# EAGLE design Teensy_PCB (EAGLE 9.4.2)
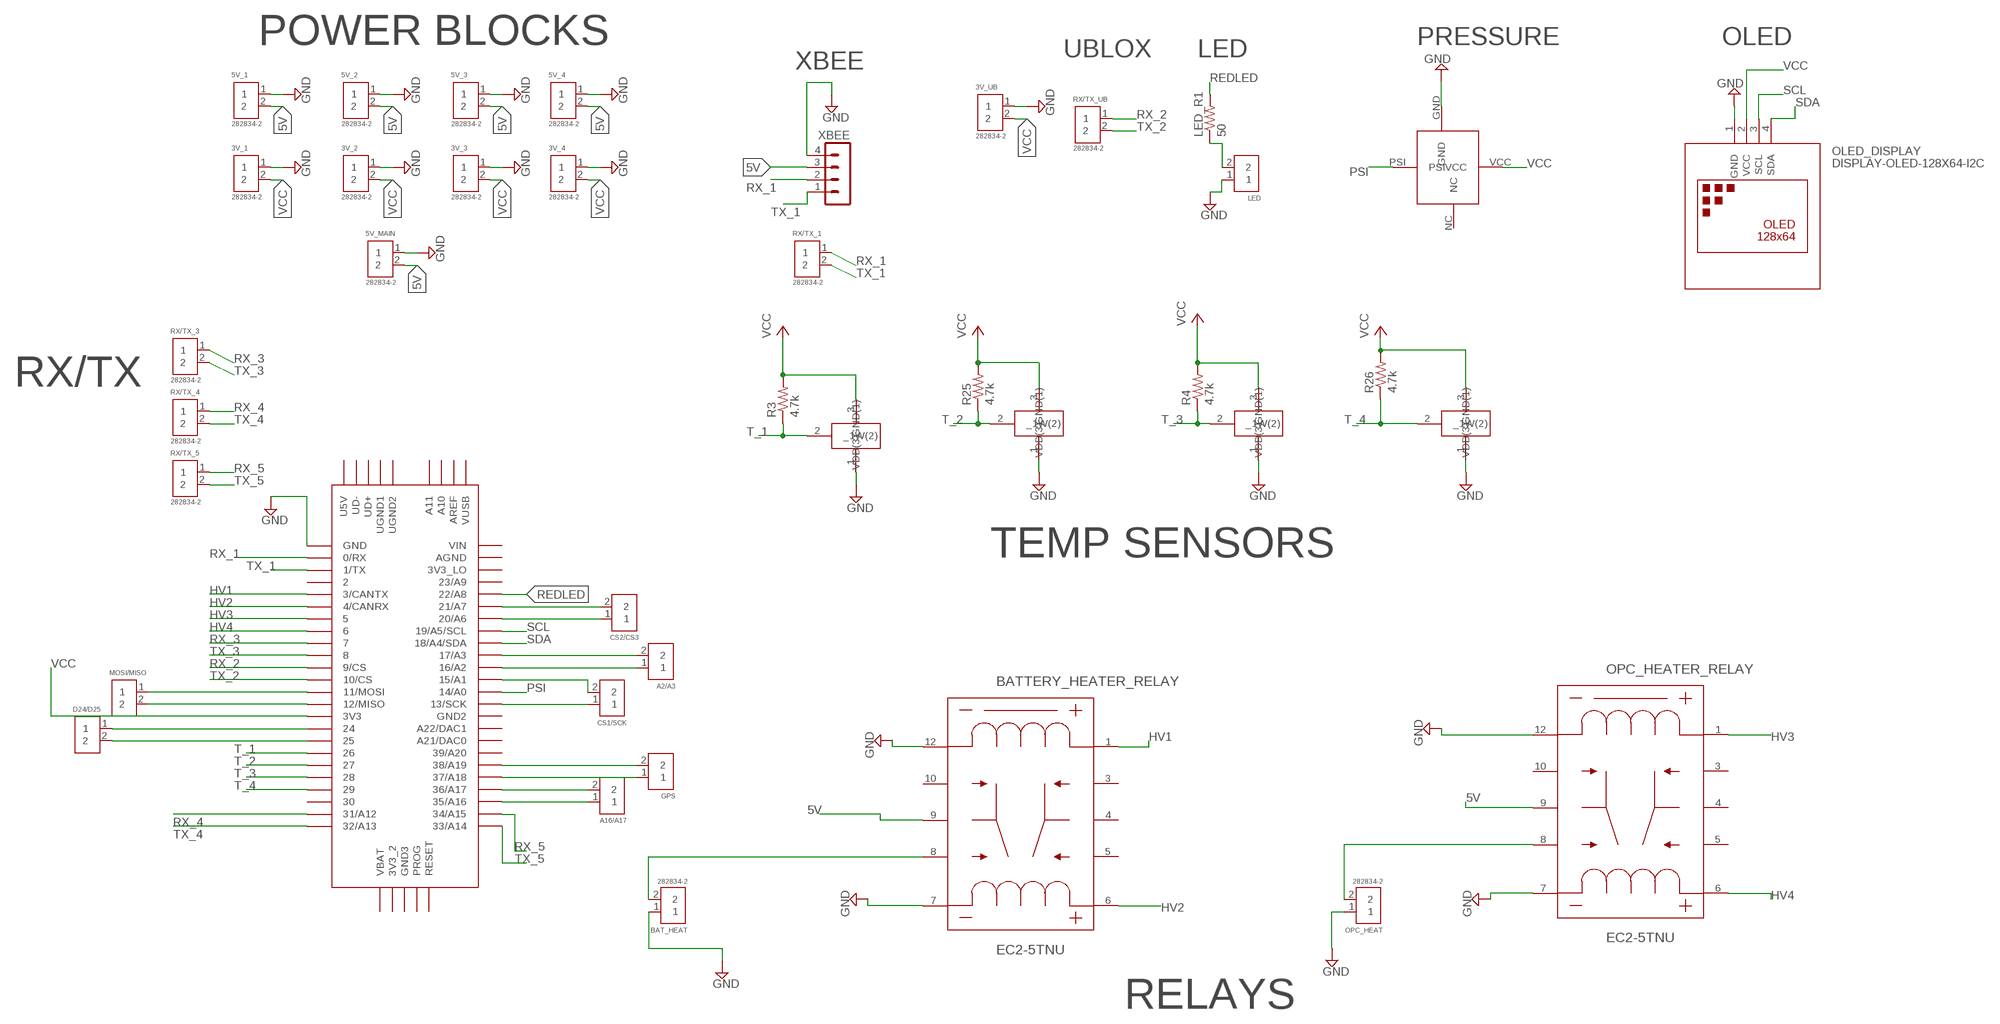
[diagram p0: schematic, sheet 1]

## Parts
3V_1  282834-2  [CONN_282834-2]
3V_2  282834-2  [CONN_282834-2]
3V_3  282834-2  [CONN_282834-2]
3V_4  282834-2  [CONN_282834-2]
3V_UB  282834-2  [CONN_282834-2]
5V_1  282834-2  [CONN_282834-2]
5V_2  282834-2  [CONN_282834-2]
5V_3  282834-2  [CONN_282834-2]
5V_4  282834-2  [CONN_282834-2]
5V_MAIN  282834-2  [CONN_282834-2]
A2/A3  282834-2  [CONN_282834-2]
A16/A17  282834-2  [CONN_282834-2]
BAT_HEAT  282834-2  [CONN_282834-2]
BATTERY_HEATER_RELAY  EC2-5TNU  [EC2TNU]
CS1/SCK  282834-2  [CONN_282834-2]
CS2/CS3  282834-2  [CONN_282834-2]
D24/D25  282834-2  [CONN_282834-2]
GPS  282834-2  [CONN_282834-2]
LED  282834-2  [CONN_282834-2]
LED_R1  50  R-US_0204/7  [0204/7]
MOSI/MISO  282834-2  [CONN_282834-2]
OLED_DISPLAY  DISPLAY-OLED-128X64-I2C  [DISPLAY-OLED-128X64-I2C]
OPC_HEAT  282834-2  [CONN_282834-2]
OPC_HEATER_RELAY  EC2-5TNU  [EC2TNU]
PRESSURE_SENSOR  SSCSANN015PAAA5  [SSCSANN015PAAA5]
R3  4.7k  R-US_0204/7  [0204/7]
R4  4.7k  R-US_0204/7  [0204/7]
R25  4.7k  R-US_0204/7  [0204/7]
R26  4.7k  R-US_0204/7  [0204/7]
RX/TX_1  282834-2  [CONN_282834-2]
RX/TX_3  282834-2  [CONN_282834-2]
RX/TX_4  282834-2  [CONN_282834-2]
RX/TX_5  282834-2  [CONN_282834-2]
RX/TX_UB  282834-2  [CONN_282834-2]
TEMP_1  DS18B20.2  [TO92-]
TEMP_2  DS18B20.2  [TO92-]
TEMP_3  DS18B20.2  [TO92-]
TEMP_4  DS18B20.2  [TO92-]
U$1  TEENSY_3.5/3.6  [TEENSY_3.5/3.6]
XBEE  MA04-1  [MA04-1]

## Nets
5V [5V_Relay]: 5V_1.2 5V_2.2 5V_3.2 5V_4.2 5V_MAIN.2 BATTERY_HEATER_RELAY.9 OPC_HEATER_RELAY.9 XBEE.3
GND [5V_Relay]: 3V_1.1 3V_2.1 3V_3.1 3V_4.1 3V_UB.1 5V_1.1 5V_2.1 5V_3.1 5V_4.1 5V_MAIN.1 BAT_HEAT.1 BATTERY_HEATER_RELAY.7 BATTERY_HEATER_RELAY.12 LED.1 OLED_DISPLAY.1(GND) OPC_HEAT.1 OPC_HEATER_RELAY.7 OPC_HEATER_RELAY.12 PRESSURE_SENSOR.GND TEMP_1.1(GND(1)) TEMP_2.1(GND(1)) TEMP_3.1(GND(1)) TEMP_4.1(GND(1)) U$1.GND XBEE.4
HV1: BATTERY_HEATER_RELAY.1 U$1.3/CANTX
HV2 [5V_Relay]: BATTERY_HEATER_RELAY.6 U$1.4/CANRX
HV3: OPC_HEATER_RELAY.1 U$1.5
HV4 [5V_Relay]: OPC_HEATER_RELAY.6 U$1.6
N$1: OPC_HEAT.2 OPC_HEATER_RELAY.8
N$2 [5V_Relay]: BAT_HEAT.2 BATTERY_HEATER_RELAY.8
N$3: MOSI/MISO.1 U$1.11/MOSI
N$4: LED.2 LED_R1.1
N$5: MOSI/MISO.2 U$1.12/MISO
N$6: CS1/SCK.2 U$1.15/A1
N$7: A2/A3.2 U$1.17/A3
N$8: CS1/SCK.1 U$1.13/SCK
N$12: A2/A3.1 U$1.16/A2
N$13: CS2/CS3.2 U$1.21/A7
N$14: CS2/CS3.1 U$1.20/A6
N$19: D24/D25.1 U$1.24
N$20: D24/D25.2 U$1.25
N$23: A16/A17.1 U$1.35/A16
N$24: A16/A17.2 U$1.36/A17
N$25: GPS.1 U$1.37/A18
N$26: GPS.2 U$1.38/A19
PSI: PRESSURE_SENSOR.PSI U$1.14/A0
REDLED: LED_R1.2 U$1.22/A8
RX_1: RX/TX_1.1 U$1.0/RX XBEE.2
RX_2: RX/TX_UB.1 U$1.9/CS
RX_3: RX/TX_3.1 U$1.7
RX_4: RX/TX_4.1 U$1.31/A12
RX_5: RX/TX_5.1 U$1.34/A15
SCL: OLED_DISPLAY.3(SCL) U$1.19/A5/SCL
SDA: OLED_DISPLAY.4(SDA) U$1.18/A4/SDA
T_1: R3.1 TEMP_1.2(_1W(2)) U$1.26
T_2: R25.1 TEMP_2.2(_1W(2)) U$1.27
T_3: R4.1 TEMP_3.2(_1W(2)) U$1.28
T_4: R26.1 TEMP_4.2(_1W(2)) U$1.29
TX_1: RX/TX_1.2 U$1.1/TX XBEE.1
TX_2: RX/TX_UB.2 U$1.10/CS
TX_3: RX/TX_3.2 U$1.8
TX_4: RX/TX_4.2 U$1.32/A13
TX_5: RX/TX_5.2 U$1.33/A14
VCC: 3V_1.2 3V_2.2 3V_3.2 3V_4.2 3V_UB.2 OLED_DISPLAY.2(VCC) PRESSURE_SENSOR.VCC R3.2 R4.2 R25.2 R26.2 TEMP_1.3(VDD(3)) TEMP_2.3(VDD(3)) TEMP_3.3(VDD(3)) TEMP_4.3(VDD(3)) U$1.3V3
Unconnected: BATTERY_HEATER_RELAY.3 BATTERY_HEATER_RELAY.4 BATTERY_HEATER_RELAY.5 BATTERY_HEATER_RELAY.10 OPC_HEATER_RELAY.3 OPC_HEATER_RELAY.4 OPC_HEATER_RELAY.5 OPC_HEATER_RELAY.10 PRESSURE_SENSOR.NC U$1.2 U$1.3V3_2 U$1.3V3_LO U$1.21/DAC0(A21/DAC0) U$1.23/A9 U$1.30 U$1.39/A20 U$1.A10 U$1.A11 U$1.A22/DAC1 U$1.AGND U$1.AREF U$1.GND2 U$1.GND3 U$1.PROG U$1.RESET U$1.U5V U$1.UD+ U$1.UD- U$1.UGND1 U$1.UGND2 U$1.VBAT U$1.VIN U$1.VUSB

## Notes on the sheet
- POWER BLOCKS | PRESSURE | OLED
- UBLOX | LED
- XBEE
- RX/TX
- TEMP SENSORS
- RELAYS

## Library data of the parts
3V_1-3V_4 3V_UB 5V_1-5V_4 5V_MAIN A2/A3 A16/A17 BAT_HEAT CS1/SCK CS2/CS3 D24/D25 GPS LED MOSI/MISO OPC_HEAT RX/TX_1 RX/TX_3-RX/TX_5 RX/TX_UB = 282834-2:282834-2: Terminal block; 2.54mm; angled 90°; 0.03÷1mm2; ways: 2; 10A; H: 10mm; CENTERLINE_PITCH: 2.54 mm[.1 in]; COMMENT: 282834-2; DESCRIPTION: TERMI-BLOK PCB MOUNT, 90 2P.; DIGI-KEY_PART_NUMBER: A98333-ND; DIGI-KEY_PURCHASE_URL: https://www.digikey.com/product-detail/en/te-connectivity-amp-connectors/282834-2/A98333-ND/1150135?utm_source=snapeda&utm_medium=aggregator&utm_campaign=symbol; EU_ROHS_COMPLIANCE: Compliant with Exemptions; MF: TE Connectivity; MP: 282834-2; NUMBER_OF_POSITIONS: 2; PACKAGE: None; TE_PURCHASE_URL: https://www.te.com/usa-en/product-282834-2.html?te_bu=Cor&te_type=disp&te_campaign=seda_glo_cor-seda-global-disp-prtnr-fy19-seda-model-bom-cta_sma-317_1&elqCampaignId=32493
BATTERY_HEATER_RELAY OPC_HEATER_RELAY = EC2-5TNU:EC2-5TNU; MANUFACTURER_PART_NUMBER: EC25TNU; VENDOR: KEMET
LED_R1 R3 R4 R25 R26 = resistor:R-US_: RESISTOR, American symbol
OLED_DISPLAY = diy-modules:DISPLAY-OLED-128X64-I2C: 128x64 Dot Matrix OLED Module based on SSD1306 chip Variant with I2C interface More details available here: http://www.instructables.com/id/Monochrome-096-i2c-OLED-display-with-arduino-SSD13/ SSD1306 datasheet: https://cdn-shop.adafruit.com/datasheets/SSD1306.pdf Click here to find device on ebay.com <http://www.ebay.com/sch/oled+display+128x64+iic> Note: There are two variants: I2C and SPI. Search for the proper version.
PRESSURE_SENSOR = SSCSANN015PAAA5:SSCSANN015PAAA5
TEMP_1-TEMP_4 = 1wire.2:DS18B20.2: Programmable Resolution Digital Thermometer This chip provides a onewire thermosensor with approx. 0.5°C accuracy. A programmable over/undertemperure alarm is available. The precision can be set from 9..12 bits. Notes: Vdd must be applied for accurate measurements at low temperatures, as the parasite power circuit otherwise heats the sensor. If parasite power is used, Vdd has to be connected to GND. The DS1822 is a low-cost thermometer chip, the DS18S20 is similar to the DS18B20, but with 9 Bit precision only.
U$1 = Teensy356:TEENSY_3.5/3.6
XBEE = con-lstb:MA04-1: PIN HEADER; OC_FARNELL: unknown; OC_NEWARK: unknown

## Net classes
1 5V_Relay: width 0.305 mm, drill 0.35 mm, clearance 0.127 mm

## Board
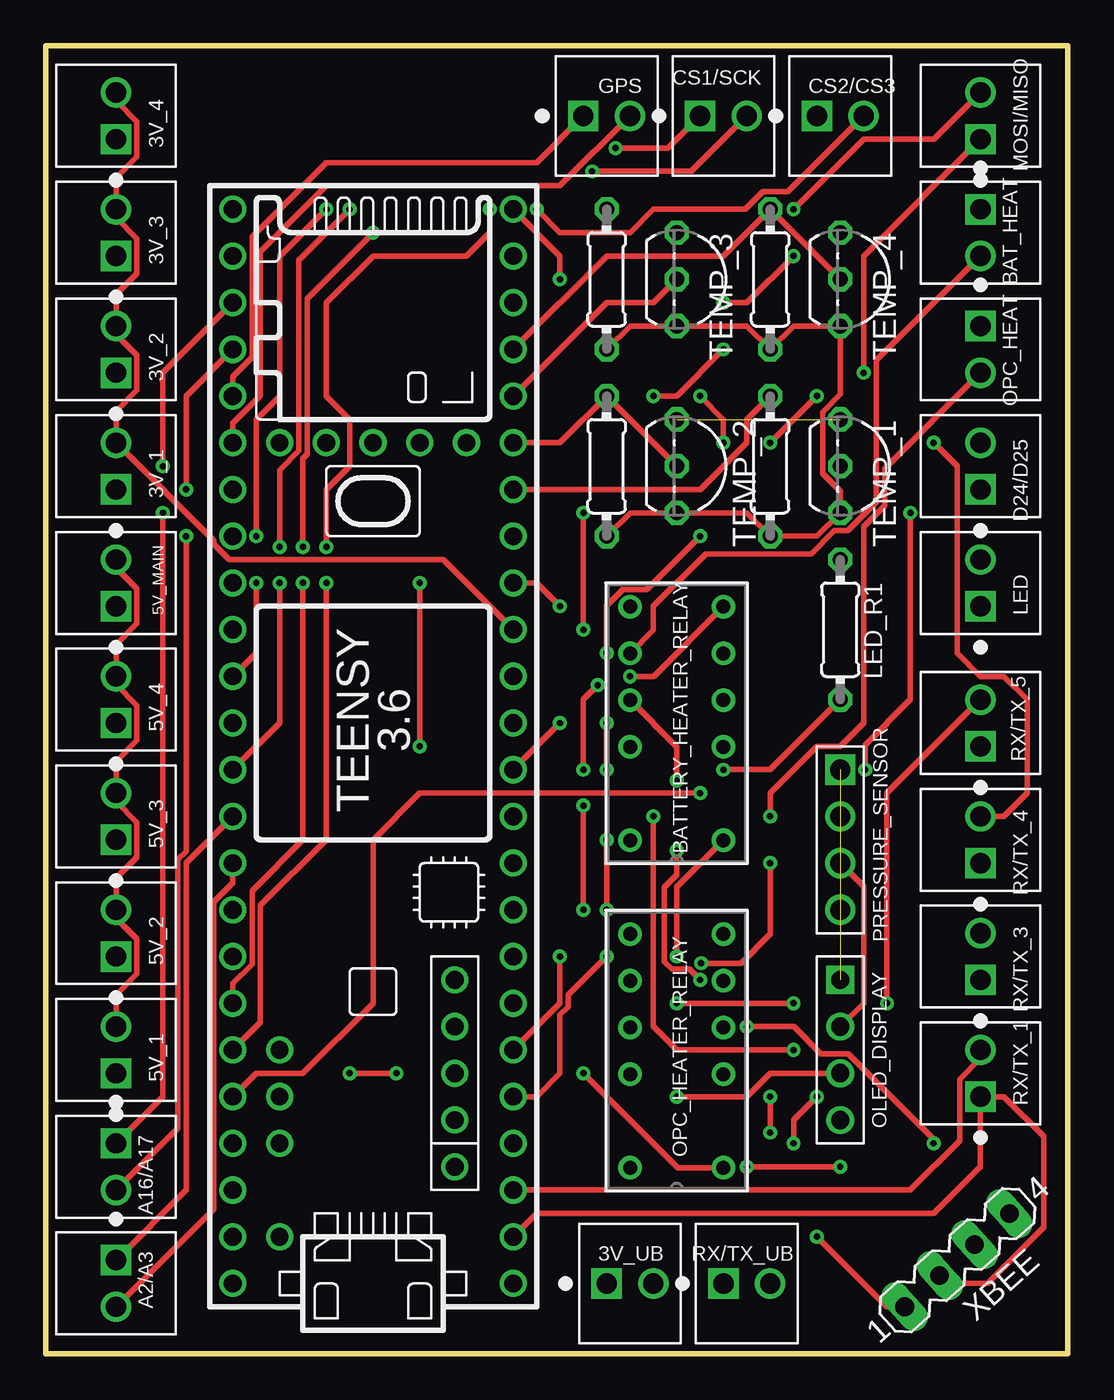
[diagram p1: board, top side]
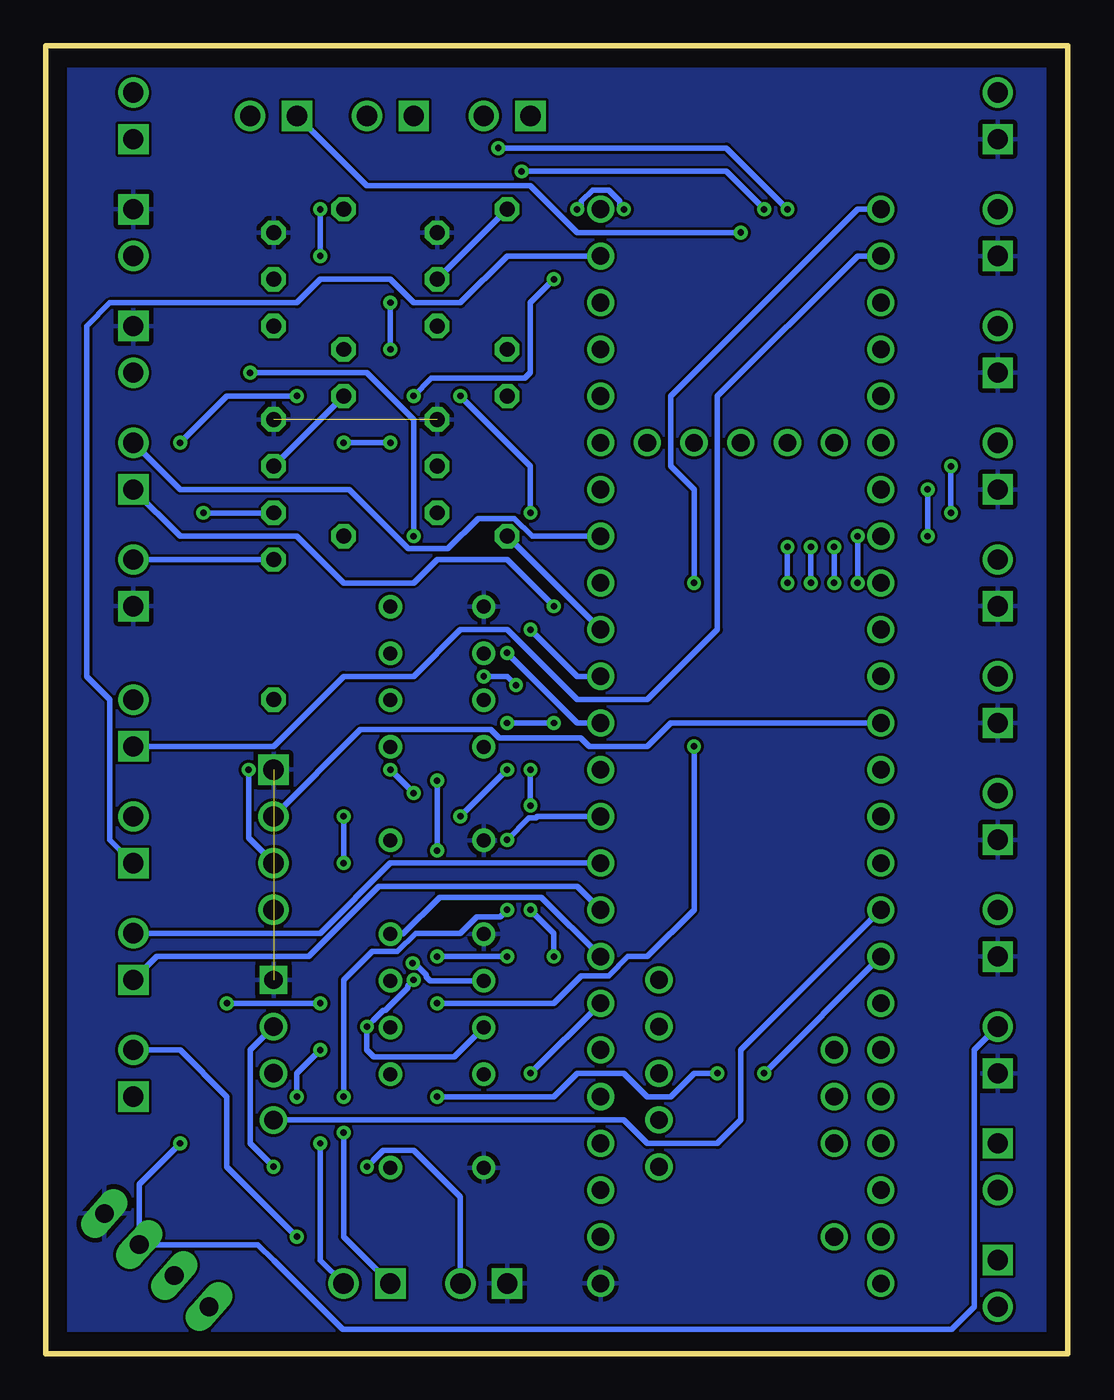
[diagram p2: board, bottom side, seen from below]

Size 55.55 x 71.11 mm. Coordinates in mm from the lower left corner, seen from the top.
Outline: 0,0 55.55,0 55.55,71.11 0,71.11 0,0
Copper layers (1*16): Top 0.035mm / dielectric 1.5mm / Bottom 0.035mm
Design rules "default": minimum track width 6mil, minimum drill 0.35mm, track to track 6mil, track to pad 6mil, pad to pad 6mil, via to via 6mil, smd to smd 6mil, copper to edge 40mil, drill to drill 6mil, minimum pad ring 10mil, minimum via ring 8mil, stop-mask expansion 4mil, vias tented up to drill 0mil, thermal gap 10mil

### Footprints (pad centres in the part's own frame; a part is rotated, then mirrored left to right if it is on the bottom)
CONN_282834-2 = drill 1.1 square: 1 -1.27,0 | drill 1.1: 2 1.27,0
EC2TNU = drill 0.762 pad 1.27: 1 -2.54,6.375; 3 -2.54,1.295; 4 -2.54,-1.245; 5 -2.54,-3.785; 6 -2.54,-6.325; 7 2.54,-6.325; 8 2.54,-3.785; 9 2.54,-1.245; 10 2.54,1.295; 12 2.54,6.375
0204/7 = drill 0.813 octagon: 1 -3.81,0; 2 3.81,0
DISPLAY-OLED-128X64-I2C = drill 1 square: 1 -3.81,0 | drill 1: 2 -1.27,0; 3 1.27,0; 4 3.81,0
SSCSANN015PAAA5 = drill 1.1 square: GND 3.81,0 | drill 1.1: NC -3.81,0; PSI 1.27,0; VCC -1.27,0
TO92- = drill 0.813 octagon: 1 -2.54,0; 2 0,0; 3 2.54,0
TEENSY_3.5/3.6 = drill 0.965: 0/RX -25.4,-7.62; 1/TX -22.86,-7.62; 2 -20.32,-7.62; 3/CANTX -17.78,-7.62; 3V3 7.62,-7.62; 3V3_2 17.78,-2.54; 3V3_LO -22.86,7.62; 4/CANRX -15.24,-7.62; 5 -12.7,-7.62; 6 -10.16,-7.62; 7 -7.62,-7.62; 8 -5.08,-7.62; 9/CS -2.54,-7.62; 10/CS 0,-7.62; 11/MOSI 2.54,-7.62; 12/MISO 5.08,-7.62; 13/SCK 5.08,7.62; 14/A0 2.54,7.62; 15/A1 0,7.62; 16/A2 -2.54,7.62; 17/A3 -5.08,7.62; 18/A4/SDA -7.62,7.62; 19/A5/SCL -10.16,7.62; 20/A6 -12.7,7.62; 21/A7 -15.24,7.62; 21/DAC0 12.7,7.62; 22/A8 -17.78,7.62; 23/A9 -20.32,7.62; 24 10.16,-7.62; 25 12.7,-7.62; 26 15.24,-7.62; 27 17.78,-7.62; 28 20.32,-7.62; 29 22.86,-7.62; 30 25.4,-7.62; 31/A12 27.94,-7.62; 32/A13 30.48,-7.62; 33/A14 30.48,7.62; 34/A15 27.94,7.62; 35/A16 25.4,7.62; 36/A17 22.86,7.62; 37/A18 20.32,7.62; 38/A19 17.78,7.62; 39/A20 15.24,7.62; A10 -17.78,5.08; A11 -15.24,5.08; A22/DAC1 10.16,7.62; AGND -25.4,7.62; AREF -20.32,5.08; GND -27.94,-7.62; GND2 7.62,7.62; GND3 17.78,0; PROG 17.78,2.54; RESET 17.78,5.08; U5V -21.59,-4.445; UD+ -16.51,-4.445; UD- -19.05,-4.445; UGND1 -13.97,-4.445; UGND2 -11.43,-4.445; VBAT 17.78,-5.08; VIN -27.94,7.62; VUSB -25.4,5.08
MA04-1 = drill 1.016 long: 1 -3.81,0; 2 -1.27,0; 3 1.27,0; 4 3.81,0

### Placement (x,y rotation side)
3V_1  3.81,48.26 90 top
3V_2  3.81,54.61 90 top
3V_3  3.81,60.96 90 top
3V_4  3.81,67.31 90 top
3V_UB  31.75,3.81 0 top
5V_1  3.81,16.51 90 top
5V_2  3.81,22.86 90 top
5V_3  3.81,29.21 90 top
5V_4  3.81,35.56 90 top
5V_MAIN  3.81,41.91 90 top
A2/A3  3.81,3.81 270 top
A16/A17  3.81,10.16 270 top
BAT_HEAT  50.8,60.96 270 top
BATTERY_HEATER_RELAY  34.29,34.29 180 top
CS1/SCK  36.83,67.31 0 top
CS2/CS3  43.18,67.31 0 top
D24/D25  50.8,48.26 90 top
GPS  30.48,67.31 0 top
LED  50.8,41.91 90 top
LED_R1  43.18,39.37 270 top
MOSI/MISO  50.8,67.31 90 top
OLED_DISPLAY  43.18,16.51 270 top
OPC_HEAT  50.8,54.61 270 top
OPC_HEATER_RELAY  34.29,16.48 180 top
PRESSURE_SENSOR  43.18,27.94 90 top
R3  39.37,48.26 270 top
R4  30.48,58.42 270 top
R25  30.48,48.26 270 top
R26  39.37,58.42 270 top
RX/TX_1  50.8,15.24 90 top
RX/TX_3  50.8,21.59 90 top
RX/TX_4  50.8,27.94 90 top
RX/TX_5  50.8,34.29 90 top
RX/TX_UB  38.1,3.81 0 top
TEMP_1  43.18,48.26 270 top
TEMP_2  34.29,48.26 270 top
TEMP_3  34.29,58.42 270 top
TEMP_4  43.18,58.42 270 top
U$1  17.78,31.75 90 top
XBEE  49.53,5.08 41.7 top

### Tracks (layer width: path | path; a pad name or v marks a point on that pad's centre or on a via)
5V  (via drill 0.35)
  Top 0.305: 5V_MAIN.2 3.81,42.72 4.94,41.59 4.94,39.69 3.81,38.56 5V_4.2 3.81,36.37 4.94,35.24 4.94,33.34 3.81,32.21 5V_3.2 3.81,30.02 4.94,28.89 4.94,26.99 3.81,25.86 5V_2.2 3.81,23.67 4.94,22.54 4.94,20.64 3.81,19.51 5V_1.2 | BATTERY_HEATER_RELAY.9 34.29,33 v34.29,31.16 | v34.29,27.35 34.29,26.02 33.61,25.34 33.61,21.31 34.01,20.91 34.97,20.91 v35.56,20.32 | v48.26,11.43 48.26,11.66 43.62,16.3 42.12,16.3 40.64,17.78 v38.1,17.78
  Bottom 0.305: 5V_1.2 5.08,16.51 5.08,2.54 6.3,1.32 39.42,1.32 43.18,5.08 | 43.18,5.08 44.02,5.93 XBEE.3 50.48,9.21 v48.26,11.43 | v34.29,31.16 v34.29,27.35 | v35.56,20.32 35.89,19.99 35.89,19.88 37.1,18.67 37.22,18.67 37.77,18.12 37.77,18.11 v38.1,17.78 38.1,16.51 37.72,16.13 33.35,16.13 OPC_HEATER_RELAY.9 | 43.18,5.08
GND  (2 unrouted)
  pour Bottom: 0,71.12 55.88,71.12 55.88,0 0,0
HV1  (via drill 0.35)
  Top 0.305: BATTERY_HEATER_RELAY.1 34.29,25.38 v34.29,21.59 | v30.48,21.59 28.4,19.51 28.4,18.86 27.94,18.4 27.94,15.24 26.67,13.97 U$1.3/CANTX
  Bottom 0.305: v34.29,21.59 v30.48,21.59
HV2  (via drill 0.35)
  Top 0.305: U$1.4/CANRX 27.94,19.05 v27.94,21.59 | v29.21,24.13 v29.21,29.8 | v29.21,31.75 29.21,35.56 v30,36.35 | BATTERY_HEATER_RELAY.6 33.05,36.83 v31.75,36.83
  Bottom 0.305: v27.94,21.59 27.94,22.86 v29.21,24.13 | v29.21,29.8 v29.21,31.75 | v30,36.35 30.48,36.83 v31.75,36.83
HV3  (via drill 0.35)
  Top 0.305: v29.21,15.24 34.34,10.11 OPC_HEATER_RELAY.1
  Bottom 0.305: U$1.5 v29.21,15.24
HV4
  Bottom 0.305: OPC_HEATER_RELAY.6 36.15,22.81 34.14,24.81 28.62,24.81 U$1.6
N$1  (via drill 0.35)
  Top 0.305: OPC_HEAT.2 45.59,48.13 45.59,46.12 44.45,44.98 44.45,34.29 43.18,33.02 41.91,33.02 39.37,30.48 v39.37,29.21 | v39.37,26.67 39.37,22.81 37.79,21.23 v35.62,21.23
  Bottom 0.305: v39.37,29.21 v39.37,26.67 | OPC_HEATER_RELAY.8 34.66,20.27 34.88,20.49 34.88,20.6 35.28,21 35.39,21 v35.62,21.23
N$2
  Top 0.305: BAT_HEAT.2 45.13,54.02 45.13,46.31 43.58,44.76 42.86,44.76 41.59,43.48 35.87,43.48 33.02,40.64 33.02,39.34 BATTERY_HEATER_RELAY.8
N$3  (via drill 0.35)
  Top 0.305: MOSI/MISO.1 44.45,59.69 v44.45,53.34 | v35.56,44.45 32.66,41.55 31.36,41.55 30.48,40.67 v30.48,38.1
  Bottom 0.305: v44.45,53.34 38.1,53.34 35.56,50.8 v35.56,44.45 | v30.48,38.1 26.67,34.29 U$1.11/MOSI
N$4
  Bottom 0.305: LED.2 LED_R1.1
N$5  (via drill 0.35)
  Top 0.305: MOSI/MISO.2 48.26,66.04 44.45,66.04 v40.64,62.23 | v40.64,59.69 38.1,57.15 v36.83,57.15 | v36.83,54.61 34.29,52.07 v33.02,52.07 | v29.21,45.72 v29.21,39.37
  Bottom 0.305: v40.64,62.23 v40.64,59.69 | v36.83,57.15 v36.83,54.61 | v33.02,52.07 29.21,48.26 v29.21,45.72 | U$1.12/MISO 26.67,36.83 v29.21,39.37
N$6  (via drill 0.35)
  Top 0.305: v29.69,64.29 35.08,64.29 CS1/SCK.2 | v12.7,43.86 12.7,48.06 13.74,49.1 13.74,59.46 v16.51,62.23 | v12.7,41.91 12.7,34.29 U$1.15/A1
  Bottom 0.305: v29.69,64.29 18.57,64.29 v16.51,62.23 | v12.7,43.86 v12.7,41.91
N$7
  Top 0.305: A2/A3.2 9.12,7.85 9.12,24.56 10.16,25.6 U$1.17/A3
N$8  (via drill 0.35)
  Top 0.305: v30.96,65.56 33.81,65.56 CS1/SCK.1 | v15.24,62.23 12.7,59.69 12.7,52.07 11.43,50.8 v11.43,44.45 | v11.43,41.91 11.43,38.1 U$1.13/SCK
  Bottom 0.305: v30.96,65.56 18.57,65.56 v15.24,62.23 | v11.43,44.45 v11.43,41.91
N$12
  Top 0.305: A2/A3.1 7.62,8.89 7.62,26.67 U$1.16/A2
N$13  (via drill 0.35)
  Top 0.305: CS2/CS3.2 40.34,63.2 38.97,63.2 38,62.23 33.02,62.23 31.75,60.96 27.94,60.96 v26.67,62.23 | v24.13,62.23 24.13,60.96 22.86,59.69 17.78,59.69 15.24,57.15 15.24,52.07 16.51,50.8 16.51,48.26 15.24,46.99 v15.24,43.86 | v15.24,41.91 15.24,27.94 11.66,24.36 11.66,18.01 U$1.21/A7
  Bottom 0.305: v26.67,62.23 26.44,62.46 26.44,62.66 25.83,63.27 24.97,63.27 24.36,62.66 24.36,62.46 v24.13,62.23 | v15.24,43.86 v15.24,41.91
N$14  (via drill 0.35)
  Top 0.305: v17.78,60.96 14.2,57.38 14.2,48.91 13.97,48.68 v13.97,43.86 | v13.97,41.91 13.97,27.94 11.2,25.17 11.2,21.16 10.16,20.12 U$1.20/A6
  Bottom 0.305: CS2/CS3.1 38.1,63.5 29.21,63.5 26.67,60.96 v17.78,60.96 | v13.97,43.86 v13.97,41.91
N$19  (via drill 0.35)
  Top 0.305: U$1.24 26.67,41.91 v27.94,40.64
  Bottom 0.305: v27.94,40.64 30.48,43.18 34.29,43.18 35.56,41.91 39.37,41.91 41.91,44.45 48.26,44.45 D24/D25.1
N$20
  Bottom 0.305: U$1.25 29.11,44.45 30.08,45.42 32.05,45.42 33.7,43.77 35.84,43.77 39.07,46.99 48.26,46.99 D24/D25.2
N$23  (via drill 0.35)
  Top 0.305: A16/A17.1 6.35,13.97 v6.35,45.72 | v6.35,48.26 6.35,53.34 U$1.35/A16
  Bottom 0.305: v6.35,45.72 v6.35,48.26
N$24  (via drill 0.35)
  Top 0.305: A16/A17.2 7.16,12.24 7.16,26.86 7.62,27.32 v7.62,44.45 | v7.62,46.99 7.62,52.07 U$1.36/A17
  Bottom 0.305: v7.62,44.45 v7.62,46.99
N$25
  Top 0.305: GPS.1 26.67,64.77 15.24,64.77 11.2,60.73 11.2,54.18 10.16,53.14 U$1.37/A18
N$26
  Top 0.305: GPS.2 27.94,63.5 15.24,63.5 11.66,59.92 11.66,52.1 10.16,50.6 U$1.38/A19
PSI
  Bottom 0.305: U$1.14/A0 21.59,34.29 22.86,33.02 26.02,33.02 26.48,33.48 30.9,33.48 31.36,33.93 38.46,33.93 PRESSURE_SENSOR.PSI
REDLED  (via drill 0.35)
  Top 0.305: U$1.22/A8 11.43,15.24 13.97,15.24 17.78,19.05 17.78,27.94 20.32,30.48 v35.56,30.48 | LED_R1.2 39.37,31.75 v36.83,31.75
  Bottom 0.305: v35.56,30.48 v36.83,31.75
RX_1
  Top 0.305: U$1.0/RX 26.67,7.62 48.26,7.62 50.8,10.16 RX/TX_1.1 52.07,13.97 54.23,11.81 54.23,6.85 51.19,3.81 49.01,3.81 XBEE.2
RX_2  (via drill 0.35)
  Top 0.305: v30.48,27.94 v30.48,24.13 | v39.37,12.02 v39.37,13.97
  Bottom 0.305: U$1.9/CS 28.83,29.21 28.93,29.11 29.31,29.11 v30.48,27.94 | v39.37,13.97 39.37,20.32 37.82,21.87 36.44,21.87 35.45,22.86 33.03,22.86 32.14,23.75 30.86,23.75 v30.48,24.13 | v39.37,12.02 39.37,6.35 RX/TX_UB.1
RX_3
  Bottom 0.305: U$1.7 26.67,25.4 37.45,25.4 41.26,21.59 49.53,21.59 RX/TX_3.1
RX_4
  Bottom 0.305: U$1.31/A12 30.48,59.69 33.02,57.15 35.56,57.15 36.83,58.42 40.64,58.42 41.91,57.15 52.07,57.15 53.34,55.88 53.34,36.83 52.07,35.56 52.07,27.94 RX/TX_4.1
RX_5
  Bottom 0.305: U$1.34/A15 11.43,59.69 19.05,52.07 19.05,39.37 22.86,35.56 26.67,35.56 30.48,39.37 33.02,39.37 35.56,36.83 39.37,36.83 43.18,33.02 RX/TX_5.1
SCL  (via drill 0.35)
  Top 0.305: v16.51,15.24 v19.05,15.24 | v34.29,13.97 38.1,13.97 39.37,15.24 OLED_DISPLAY.3
  Bottom 0.305: U$1.19/A5/SCL v16.51,15.24 | v19.05,15.24 20.32,15.24 21.59,13.97 22.86,13.97 24.13,15.24 26.67,15.24 27.94,13.97 v34.29,13.97
SDA
  Bottom 0.305: U$1.18/A4/SDA 17.78,16.51 17.78,12.7 19.05,11.43 22.86,11.43 24.13,12.7 OLED_DISPLAY.4
T_1
  Top 0.305: U$1.26 35.56,46.99 38.1,49.53 38.1,50.8 R3.1
  Bottom 0.305: R3.1 TEMP_1.2
T_2
  Top 0.305: TEMP_2.2 R25.1 27.94,49.53 U$1.27
T_3
  Top 0.305: U$1.28 30.48,57.15 33.02,57.15 TEMP_3.2
  Bottom 0.305: R4.1 TEMP_3.2
T_4
  Top 0.305: TEMP_4.2 R26.1 36.83,59.69 30.48,59.69 U$1.29
TX_1  (via drill 0.35)
  Top 0.305: U$1.1/TX 46.99,8.89 49.67,11.57 49.67,14.92 50.8,16.05 RX/TX_1.2 | XBEE.1 45.72,2.55 v41.91,6.35
  Bottom 0.305: RX/TX_1.2 48.26,16.51 45.72,13.97 45.72,10.16 v41.91,6.35
TX_2  (via drill 0.35)
  Top 0.305: U$1.10/CS v27.94,34.29 | v30.48,34.29 v30.48,31.75 | v33.02,29.21 33.02,17.78 34.29,16.51 v40.64,16.51 | v41.91,13.97 40.64,12.7 v40.64,11.43
  Bottom 0.305: v27.94,34.29 v30.48,34.29 | v30.48,31.75 v33.02,29.21 | v40.64,16.51 41.91,15.24 v41.91,13.97 | v40.64,11.43 40.64,5.08 RX/TX_UB.2
TX_3
  Bottom 0.305: U$1.8 36.83,26.67 40.64,22.86 RX/TX_3.2
TX_4  (via drill 0.35)
  Top 0.305: U$1.32/A13 27.94,59.69 v27.94,58.42 | v35.56,52.07 36.83,50.8 v36.83,49.53 | v39.37,49.53 v41.91,52.07 | v48.26,49.53 49.53,48.26 49.53,38.1 50.8,36.83 52.07,36.83 53.34,35.56 53.34,30.48 52.07,29.21 RX/TX_4.2
  Bottom 0.305: v27.94,58.42 29.21,57.15 29.21,53.34 29.52,53.03 34.59,53.03 v35.56,52.07 | v36.83,49.53 v39.37,49.53 | v41.91,52.07 45.72,52.07 v48.26,49.53
TX_5  (via drill 0.35)
  Top 0.305: v45.72,19.05 45.72,30.48 RX/TX_5.2 | v40.64,19.05 v34.29,19.05 | v20.32,33.02 v20.32,41.91
  Bottom 0.305: v45.72,19.05 v40.64,19.05 | v34.29,19.05 27.94,19.05 26.44,20.55 24.97,20.55 23.93,21.59 22.86,21.59 20.32,24.13 v20.32,33.02 | v20.32,41.91 20.32,46.99 21.59,48.26 21.59,52.07 11.43,62.23 U$1.33/A14
VCC  (via drill 0.35)
  Top 0.305: U$1.3V3 21.59,43.18 9.96,43.18 9.12,44.02 9.12,44.22 3V_1.2 3.81,51.26 4.94,52.39 4.94,54.29 3.81,55.42 3V_2.2 3.81,57.61 4.94,58.74 4.94,60.64 3.81,61.77 3V_3.2 3.81,63.96 4.94,65.09 4.94,66.99 3.81,68.12 3V_4.2 | R4.2 31.75,55.88 TEMP_3.3 38.1,55.88 R26.2 40.64,55.88 TEMP_4.3 43.18,52.17 42.22,51.2 42.22,47.86 43.18,46.89 TEMP_1.3 41.91,44.45 R3.2 38.1,45.72 TEMP_2.3 31.75,45.72 R25.2 | PRESSURE_SENSOR.VCC 44.45,25.4 44.45,19.05 OLED_DISPLAY.2 | v38.1,10.16 v43.18,10.16 | v44.54,31.75 44.54,33.11 46.99,35.56 v46.99,45.72
  Bottom 0.305: R25.2 U$1.3V3 | v38.1,10.16 37.77,10.49 37.77,10.5 37.22,11.05 35.56,11.05 33.02,8.51 3V_UB.2 | v43.18,10.16 44.45,11.43 44.45,16.51 OLED_DISPLAY.2 | PRESSURE_SENSOR.VCC 44.54,28.03 v44.54,31.75 | v46.99,45.72 TEMP_1.3

### Text on the board
tOrigins: OBAMA-MURI V1 | Created by Akshay Naik